# EAGLE design SB_TS_0.53_d (EAGLE 5.04)
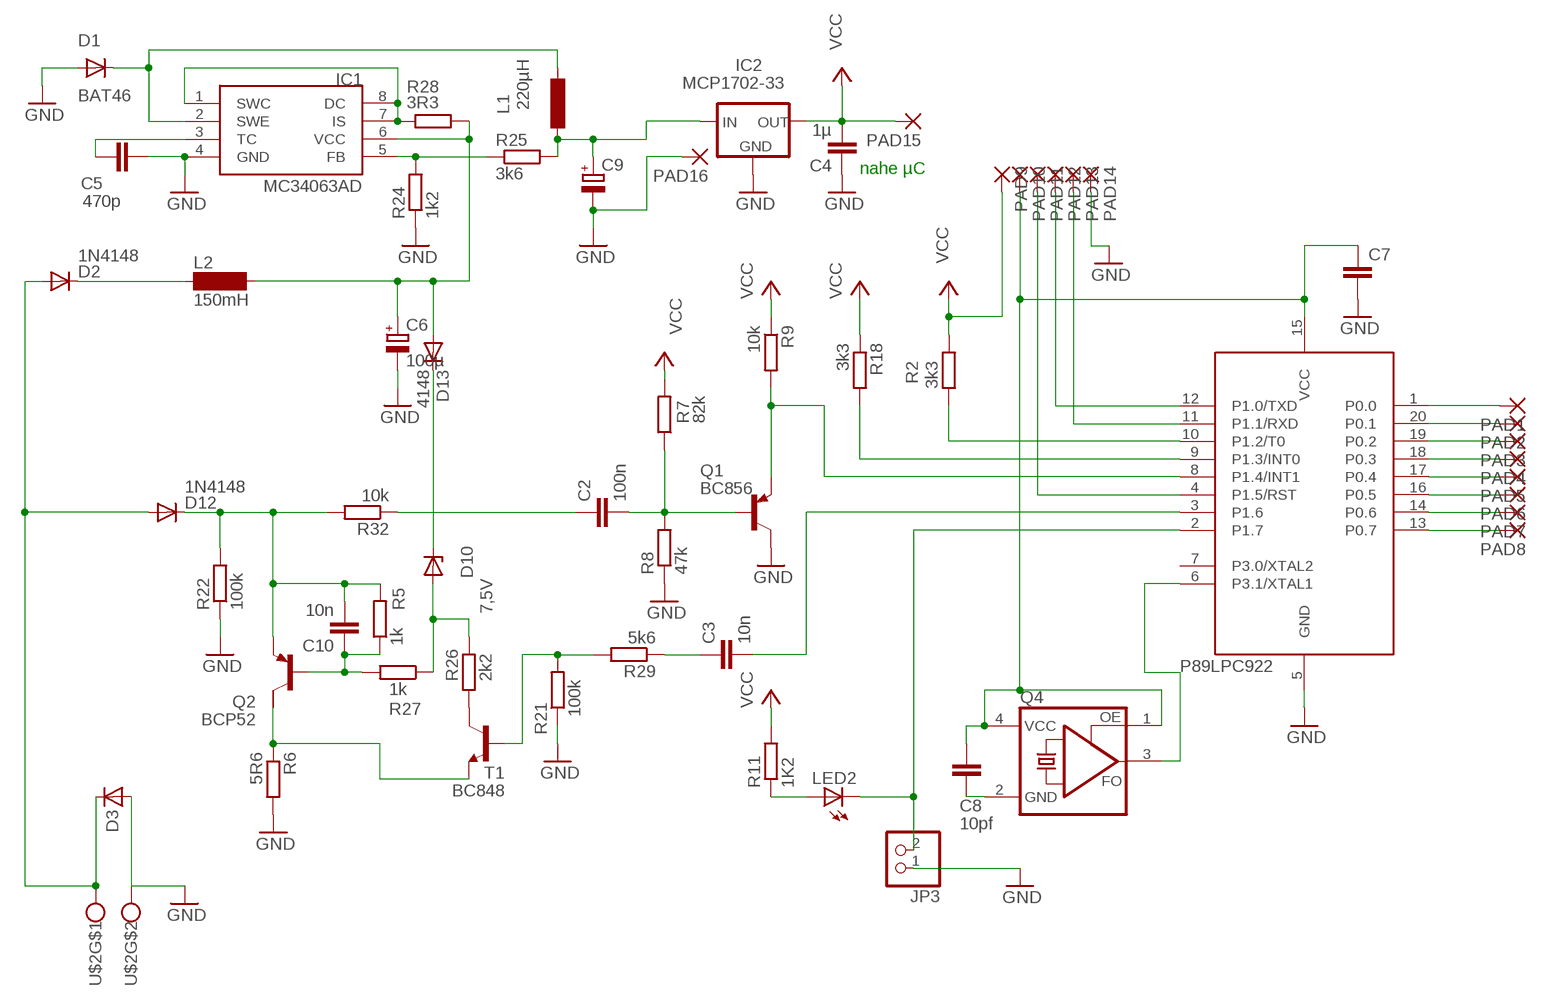
[diagram p0: schematic, sheet 1]

## Parts
C2  100n  C-EUC1206  [C1206]
C3  10n  C-EUC1206  [C1206]
C4  1µ  C-EUC1206  [C1206]
C5  470p  C-EUC1206  [C1206]
C6  100µ  CPOL-EUE5-8.5  [E5-8,5]
C7  C-EUC1206  [C1206]
C8  10pf  C-EUC1206  [C1206]
C9  CPOL-EUE2.5-5  [E2,5-5]
C10  10n  C-EUC1206  [C1206]
D1  BAT46  DIODE-MINIMELF  [MINIMELF]
D2  1N4148  DIODE-MINIMELF  [MINIMELF]
D3  SMAJ40AC  D-SMB  [SMB]
D10  7,5V  ZPD  [MINIMELF]
D12  1N4148  DIODE-MINIMELF  [MINIMELF]
D13  4148  DIODE-MINIMELF  [MINIMELF]
IC1  MC34063AD  [SOIC8]
IC2  MCP1702-33  79LXX  [79LXX]
JP3  PINHD-1X2  [1X02]
L1  220µH  L-EU2200-11.43  [2200-11.43]
L2  150mH  SD12-1000  [SD12_1000]
LED2  LED3MM  [LED3MM]
PAD1  SMD2  [SMD1,27-2,54]
PAD2  SMD2  [SMD1,27-2,54]
PAD3  SMD2  [SMD1,27-2,54]
PAD4  SMD2  [SMD1,27-2,54]
PAD5  SMD2  [SMD1,27-2,54]
PAD6  SMD2  [SMD1,27-2,54]
PAD7  SMD2  [SMD1,27-2,54]
PAD8  SMD2  [SMD1,27-2,54]
PAD9  SMD2  [SMD1,27-2,54]
PAD10  SMD2  [SMD1,27-2,54]
PAD11  SMD2  [SMD1,27-2,54]
PAD12  SMD2  [SMD1,27-2,54]
PAD13  SMD2  [SMD1,27-2,54]
PAD14  SMD2  [SMD1,27-2,54]
PAD15  SMD2  [SMD1,27-2,54]
PAD16  SMD2  [SMD1,27-2,54]
Q1  BC856  BC856ALT1SMD  [SOT23-BEC]
Q2  BCP52  FZT753SMD  [SOT223]
Q4  ASFL  [ASF]
R2  3k3  R-EU_M1206  [M1206]
R5  1k  R-EU_R1206  [R1206]
R6  5R6  R-EU_R1206  [R1206]
R7  82k  R-EU_R1206  [R1206]
R8  47k  R-EU_M1206  [M1206]
R9  10k  R-EU_R1206  [R1206]
R11  1K2  R-EU_R1206  [R1206]
R18  3k3  R-EU_R1206  [R1206]
R21  100k  R-EU_R1206  [R1206]
R22  100k  R-EU_M1206  [M1206]
R24  1k2  R-EU_R1206  [R1206]
R25  3k6  R-EU_M1206  [M1206]
R26  2k2  R-EU_M1206  [M1206]
R27  1k  R-EU_R1206  [R1206]
R28  3R3  R-EU_M1206  [M1206]
R29  5k6  R-EU_R1206  [R1206]
R32  10k  R-EU_R1206  [R1206]
T1  BC848  [SOT23]
U1  89LPC922  [DIL20]
U$2  AKL059-02  [AKL3.5X2]

## Nets
DRAIN: R26.1 T1.3(C)
EIB+: D2.A D3.1(C) D12.A U$2.1
EIB_DC1: C6.+ D13.A IC1.6(VCC) L2.2 R28.2
EIB_SEND: C3.2 U1.3(P1.6)
EIBIN: Q1.E R9.2 U1.8(P1.4/INT1)
GATE: R21.2 R29.2 T1.1(B)
GND: C4.1 C5.2 C6.- C7.2 C9.- D1.A D3.2(A) IC1.4(GND) IC2.GND JP3.1 PAD14.1(P) PAD16.1(P) Q1.C R6.2 R8.1 R21.1 R22.1 R24.1 U1.5(GND) U$2.2
INT0: R18.2 U1.9(P1.3/INT0)
N$1: C10.1 Q2.1(B) R5.1 R27.2
N$2: C3.1 R29.1
N$3: C9.+ IC2.IN L1.1 R25.2
N$5: C10.2 D12.C Q2.3(E) R5.2 R22.2 R32.2
N$6: Q2.2(C) R6.1 T1.2(E)
N$8: D2.C L2.1
N$15: PAD5.1(P) U1.17(P0.4)
N$16: PAD11.1(P) U1.4(P1.5/RST)
N$17: JP3.2 LED2.K(C) U1.2(P1.7)
N$19: LED2.A R11.1
N$20: PAD3.1(P) U1.19(P0.2)
N$21: PAD1.1(P) U1.1(P0.0)
N$22: PAD2.1(P) U1.20(P0.1)
N$23: PAD4.1(P) U1.18(P0.3)
N$24: PAD12.1(P) U1.12(P1.0/TXD)
N$25: Q4.3(FO) U1.6(P3.1/XTAL1)
N$26: PAD13.1(P) U1.11(P1.1/RXD)
N$27: C8.2 Q4.2(GND)
N$28: PAD6.1(P) U1.16(P0.5)
N$29: PAD8.1(P) U1.13(P0.7)
N$30: PAD7.1(P) U1.14(P0.6)
N$31: C2.2 Q1.B R7.1 R8.2
N$50: IC1.5(FB) R24.2 R25.1
N$51: D1.C IC1.2(SWE) L1.2
N$52: C5.1 IC1.3(TC)
N$55: D10.A R26.2 R27.1
N$58: D10.C D13.C
N$63: IC1.1(SWC) IC1.7(IS) IC1.8(DC) R28.1
N$77: C2.1 R32.1
PWM: R2.2 U1.10(P1.2/T0)
VCC: C4.2 IC2.OUT PAD9.1(P) PAD15.1(P) R2.1 R7.2 R9.1 R11.2 R18.1
VCC_LPC: C7.1 C8.1 PAD10.1(P) Q4.1(OE) Q4.4(VCC) U1.15(VCC)
Unconnected: Q2.4(C/) U1.7(P3.0/XTAL2)

## Notes on the sheet
- nahe µC
- P89LPC922

## Library data of the parts
C2-C5 C7 C8 C10 = rcl:C-EU: CAPACITOR, European symbol
C6 C9 = rcl:CPOL-EU: POLARIZED CAPACITOR, European symbol
D1 D2 D12 D13 = diode:DIODE-: DIODE
D3 = semicon-smd-ipc:D-: DIODE unfilled
D10 = diode:ZPD: Z DIODE 500 mW
IC1 = mc34063:MC34063
IC2 = v-reg:79LXX: VOLTAGE REGULATOR
JP3 = pinhead:PINHD-1X2: PIN HEADER
L1 = rcl:L-EU: INDUCTOR, European symbol
L2 = inductor-neosid:SD12: INDUCTOR nominal inductance
LED2 = led:LED: LED OSRAM: - CHIPLED LG R971, LG N971, LY N971, LG Q971, LY Q971, LO R971, LY R971 LH N974, LH R974 LS Q976, LO Q976, LY Q976 LO Q996 - Hyper CHIPLED LW Q18S LB Q993, LB Q99A, LB R99A - SideLED LS A670, LO A670, LY A670, LG A670, LP A670 LB A673, LV A673, LT A673, LW A673 LH A674 LY A675 LS A676, LA A676, LO A676, LY A676, LW A676 LS A679, LY A679, LG A679 - Hyper Micro SIDELED® LS Y876, LA Y876, LO Y876, LY Y876 LT Y87S - SmartLED LW L88C, LW L88S LB L89C, LB L89S, LG L890 LS L89K, LO L89K, LY L89K LS L896, LA L896, LO L896, LY L896 - TOPLED LS T670, LO T670, LY T670, LG T670, LP T670 LSG T670, LSP T670, LSY T670, LOP T670, LYG T670 LG T671, LOG T671, LSG T671 LB T673, LV T673, LT T673, LW T673 LH T674 LS T676, LA T676, LO T676, LY T676, LB T676, LH T676, LSB T676, LW T676 LB T67C, LV T67C, LT T67C, LS T67K, LO T67K, LY T67K, LW E67C LS E67B, LA E67B, LO E67B, LY E67B, LB E67C, LV E67C, LT E67C LW T67C LS T679, LY T679, LG T679 LS T770, LO T770, LY T770, LG T770, LP T770 LB T773, LV T773, LT T773, LW T773 LH T774 LS E675, LA E675, LY E675, LS T675 LS T776, LA T776, LO T776, LY T776, LB T776 LHGB T686 LT T68C, LB T68C - Hyper Mini TOPLED® LB M676 - Mini TOPLED Santana® LG M470 LS M47K, LO M47K, LY M47K Source: http://www.osram.convergy.de - LUMILED® LXK2-PW12-R00, LXK2-PW12-S00, LXK2-PW14-U00, LXK2-PW14-V00 LXK2-PM12-R00, LXK2-PM12-S00, LXK2-PM14-U00 LXK2-PE12-Q00, LXK2-PE12-R00, LXK2-PE12-S00, LXK2-PE14-T00, LXK2-PE14-U00 LXK2-PB12-K00, LXK2-PB12-L00, LXK2-PB12-M00, LXK2-PB14-N00, LXK2-PB14-P00, LXK2-PB14-Q00 LXK2-PR12-L00, LXK2-PR12-M00, LXK2-PR14-Q00, LXK2-PR14-R00 LXK2-PD12-Q00, LXK2-PD12-R00, LXK2-PD12-S00 LXK2-PH12-R00, LXK2-PH12-S00 LXK2-PL12-P00, LXK2-PL12-Q00, LXK2-PL12-R00 Source: www.luxeon.com
PAD1-PAD16 = wirepad:SMD2: SMD PAD
Q1 = transistor-pnp:BC856*: PNP Transistror
Q2 = transistor-pnp:FZT753SMD: PNP Transistor
Q4 = crystal:ASF*: CRYSTAL CLOCK OSCILLATORS 5.0 Vdc or 3.3 Vdc - LOW PROFILE ULTRA MINIATURE CERAMIC SURFACE MOUNT Source: http://www.abracon.com/Oscillators/asf1-L-L1.pdf
R2 R5-R9 R11 R18 R21 R22 R24-R29 R32 = rcl:R-EU_: RESISTOR, European symbol
T1 = transistor:BC848: NPN TRANSISTOR
U1 = micro-philips:89LPC922
U$2 = con-wago-500:AKL059-02

## Board
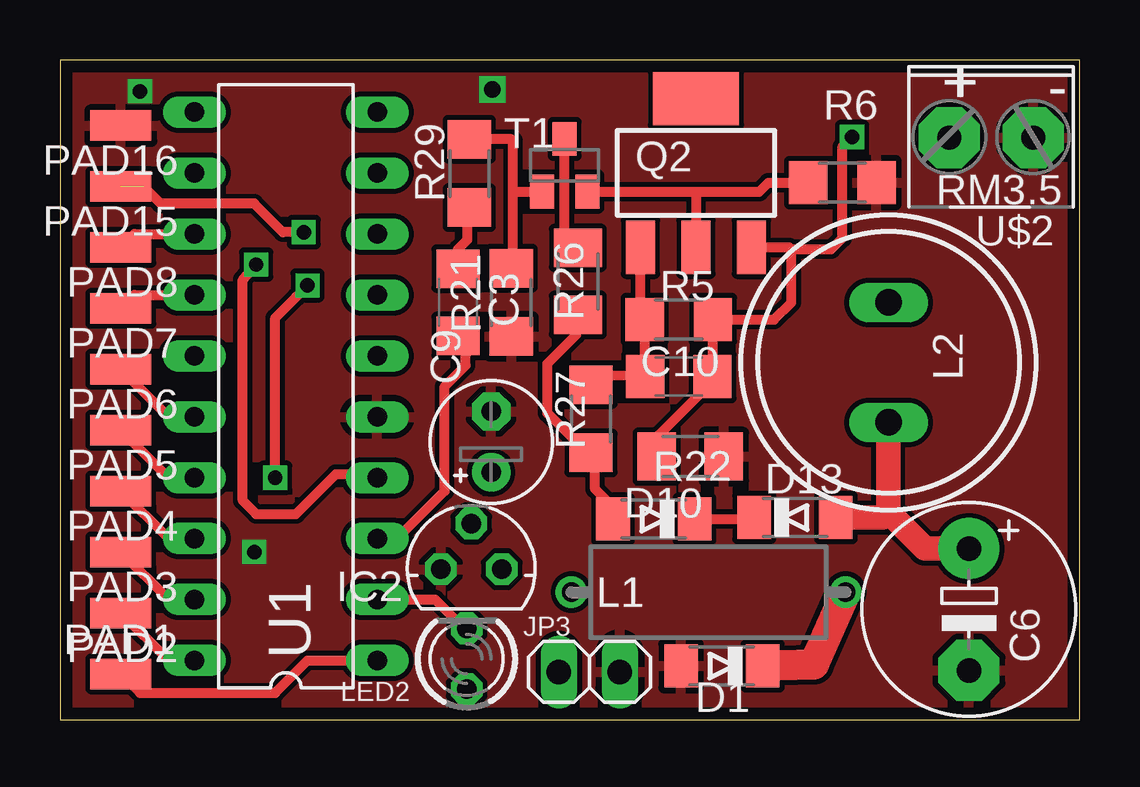
[diagram p1: board, top side]
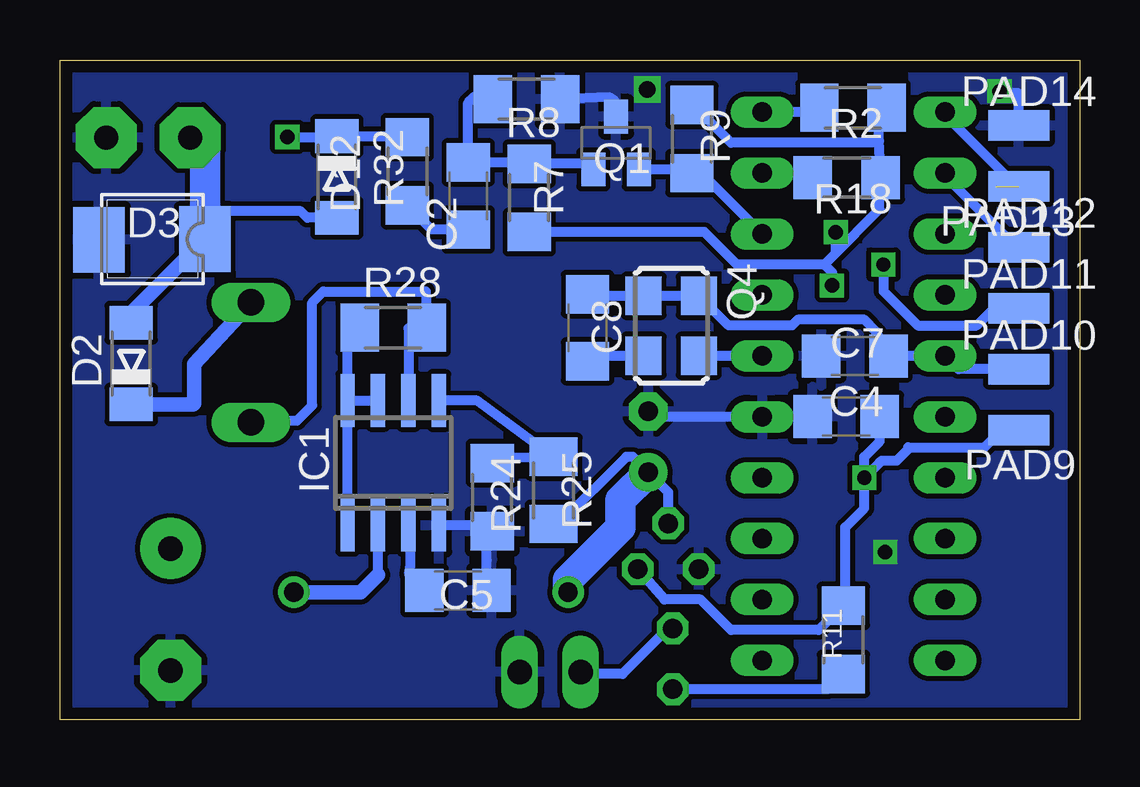
[diagram p2: board, bottom side, seen from below]

Size 42.5 x 27.5 mm. Coordinates in mm from the lower left corner, seen from the top.
Outline: 0,0 42.5,0 42.5,27.5 0,27.5 0,0
Copper layers (1*16): Top 0.035mm / dielectric 1.5mm / Bottom 0.035mm
Design rules "default *": minimum track width 10mil, minimum drill 24mil, track to track 8mil, track to pad 8mil, pad to pad 8mil, via to via 8mil, smd to smd 8mil, copper to edge 20mil, drill to drill 8mil, minimum pad ring 10mil, minimum via ring 8mil, stop-mask expansion 4mil, vias tented up to drill 0mil, thermal gap 10mil

### Footprints (pad centres in the part's own frame; a part is rotated, then mirrored left to right if it is on the bottom)
C1206 = smd 1.6 x 1.8: 1 -1.4,0; 2 1.4,0
E5-8,5 = drill 1.016 pad 2.54 round: + -2.54,0 | drill 1.016 pad 2.54 octagon: - 2.54,0
E2,5-5 = drill 0.813 pad 1.6 round: + -1.27,0 | drill 0.813 pad 1.6 octagon: - 1.27,0
MINIMELF = smd 1.4 x 1.8: A 1.7,0; C -1.7,0
SMB = smd 2.159 x 2.743: 1 -2.311,-0.127; 2 2.108,-0.102
SOIC8 = smd 0.6 x 2.2: 1 -1.905,-2.6; 2 -0.635,-2.6; 3 0.635,-2.6; 4 1.905,-2.6; 5 1.905,2.6; 6 0.635,2.6; 7 -0.635,2.6; 8 -1.905,2.6
79LXX = drill 0.813 octagon: GND -1.27,0; IN 0,1.905; OUT 1.27,0
1X02 = drill 1.016 long: 1 -1.27,0; 2 1.27,0
2200-11.43 = drill 0.8 pad 1.27 round: 1 -5.715,0; 2 5.715,0
SD12_1000 = drill 1.1 long: 1 -2.5,0; 2 2.5,0
LED3MM = drill 0.813 octagon: A -1.27,0; K 1.27,0
SMD1,27-2,54 = smd 1.27 x 2.54: 1 0,0
SOT23-BEC = smd 1 x 1.4: B -0.95,-1.1; C 0,1.1; E 0.95,-1.1
SOT223 = smd 1.219 x 2.235: 1 -2.311,-3.099; 2 0,-3.099; 3 2.311,-3.099 | smd 3.6 x 2.2: 4 0,3.099
ASF = smd 1.6 x 1.5: 1 -1.25,-1.15; 2 1.25,-1.15; 3 1.25,1.15; 4 -1.25,1.15
M1206 = smd 1.6 x 2: 1 -1.4,0; 2 1.4,0
R1206 = smd 1.6 x 1.803: 1 -1.422,0; 2 1.422,0
SOT23 = smd 1 x 1.4: 1 -0.95,-1.1; 2 0.95,-1.1; 3 0,1.1
DIL20 = drill 0.813 long: 1 -11.43,-3.81; 2 -8.89,-3.81; 3 -6.35,-3.81; 4 -3.81,-3.81; 5 -1.27,-3.81; 6 1.27,-3.81; 7 3.81,-3.81; 8 6.35,-3.81; 9 8.89,-3.81; 10 11.43,-3.81; 11 11.43,3.81; 12 8.89,3.81; 13 6.35,3.81; 14 3.81,3.81; 15 1.27,3.81; 16 -1.27,3.81; 17 -3.81,3.81; 18 -6.35,3.81; 19 -8.89,3.81; 20 -11.43,3.81
AKL3.5X2 = drill 1 pad 2.54 octagon: 1 -1.75,-0.1; 2 1.75,-0.1

### Placement (x,y rotation side)
C2  25.48,21.83 90 bottom
C3  16.59,17.39 270 top
C4  9.73,12.63 0 bottom
C5  25.91,5.38 0 bottom
C6  37.89,4.59 270 top
C7  9.37,15.16 180 bottom
C8  20.51,16.34 270 bottom
C9  17.97,11.57 90 top
C10  25.8,14.3 0 top
D1  27.59,2.24 180 top
D2  39.53,14.84 90 bottom
D3  38.77,19.9 180 bottom
D10  24.75,8.36 180 top
D12  30.96,22.62 270 bottom
D13  30.64,8.42 0 top
IC1  28.61,10.7 0 bottom
IC2  17.14,6.27 0 top
JP3  22.07,1.98 180 top
L1  27.04,5.31 0 top
L2  34.54,14.89 270 top
LED2  16.95,2.53 90 top
PAD1  2.54,1.91 270 top
PAD2  2.54,4.45 90 top
PAD3  2.54,6.99 90 top
PAD4  2.54,9.53 90 top
PAD5  2.54,12.06 90 top
PAD6  2.54,14.61 90 top
PAD7  2.54,17.14 90 top
PAD8  2.54,19.68 90 top
PAD9  2.54,12.06 90 bottom
PAD10  2.54,14.61 270 bottom
PAD11  2.54,17.14 270 bottom
PAD12  2.54,19.68 270 bottom
PAD13  2.54,22.23 90 bottom
PAD14  2.54,24.77 270 bottom
PAD15  2.54,22.23 90 top
PAD16  2.54,24.77 90 top
Q1  19.32,24.04 0 bottom
Q2  26.51,22.79 0 top
Q4  17.02,16.42 270 bottom
R2  9.44,25.5 180 bottom
R5  25.8,16.68 0 top
R6  32.61,22.38 0 top
R7  22.94,21.75 270 bottom
R8  23.05,25.86 180 bottom
R9  16.15,24.2 270 bottom
R11  9.85,3.32 90 bottom
R18  9.71,22.6 180 bottom
R21  18.81,17.39 90 top
R22  26.27,10.97 180 top
R24  24.48,9.27 90 bottom
R25  21.92,9.56 270 bottom
R26  21.59,18.27 270 top
R27  22.13,12.54 90 top
R28  28.61,16.34 0 bottom
R29  17.07,22.77 90 top
R32  28.02,22.86 90 bottom
T1  21.04,23.11 0 top
U1  9.41,13.89 90 top
U$2  38.81,24.37 0 top

### Tracks (layer width: path | path; a pad name or v marks a point on that pad's centre or on a via)
DRAIN
  Top 0.406: 21.43,19.59 R26.1 21.04,20.22 T1.3
EIB+
  Bottom 0.406: D12.A 32.19,20.92 32.46,21.19 36.46,21.19
  Bottom 0.61: D2.A 39.53,16.96 D3.1
  Bottom 1.27: D3.1 36.46,21.19 36.46,23.66 U$2.1
EIB_DC1
  Top 1.016: C6.+ 36.05,7.13 34.53,8.65 | 34.53,8.65 34.53,12.38 L2.2 | D13.A 34.3,8.43 34.53,8.65
  Bottom 0.406: IC1.6 27.97,16.31 R28.2 27.21,16.52 27.26,17.84 31.53,17.84 31.99,17.38 31.99,13.1 32.62,12.46 34.47,12.46 L2.2
EIB_SEND
  Top 0.406: U1.3 14.05,7.54 16.03,9.53 16.03,13.89 16.91,14.76 16.91,15.2 C3.2
EIBIN
  Bottom 0.406: Q1.E 16.31,22.94 R9.2 15.76,22.78 U1.8
GATE
  Top 0.406: R29.2 18.83,24.19 18.89,24.13 18.89,22.07 | 18.89,22.07 18.89,18.89 R21.2 | T1.1 18.95,22.01 18.89,22.07
GND  (via drill 0.6, 0.7)
  Top 0.406: R21.1 19.37,16.13
  Bottom 0.406: C5.2 24.75,5.75 24.72,6.65 24.72,7.93 R24.1 | IC1.4 24.73,8.1 R24.1 | R24.1 24.33,8.32 | R8.1 19.59,25.94 19.37,25.8 19.37,25.18 Q1.C | C4.1 U1.5 17.75,12.62 C9.- | PAD16.1 2.54,26.11 3.25,26.11 v3.33,26.19
  other vias: 18.02,26.27 8.1,6.99
  pour Bottom: -0.95,28.1 42.78,28.1 43.02,27.94 43.02,-0.16 42.62,-0.48 -0.24,-0.48 -0.32,-0.4 -0.32,10.56 -0.64,10.87
  pour Top: -0.32,-0.79 -0.32,28.34 42.86,28.34 42.86,-0.71 3.41,-0.71
INT0
  Bottom 0.406: U1.9 11.39,22.78 R18.2
N$1
  Top 0.406: Q2.1 24.2,16.86 R5.1 24.38,14.32 | 24.38,14.32 C10.1 | 24.38,14.32 22.78,14.37 R27.2
N$2
  Top 0.406: C3.1 16.59,19.61 16.99,20 16.99,21.27 R29.1
N$3
  Bottom 0.406: IC2.IN 17.14,9.48 C9.+ 18.62,10.95 18.89,10.95 21.69,8.16 R25.2
  Bottom 1.27: L1.1 21.32,5.83 19.13,8.02 19.13,9.15 C9.+
N$5  (via drill 0.6)
  Top 0.406: 32.99,24.32 v33.02,24.29 32.62,23.89 32.62,20.08 32.15,19.61 30.48,19.61 | Q2.3 30.4,19.68 30.48,19.61 | 30.48,19.61 30.48,17.38 29.77,16.67 27.72,16.67 27.71,16.68 R5.2 27.23,14.33 C10.2 27.2,14.1 24.92,11.83 24.92,11.02 R22.2
  Bottom 0.406: R32.2 28.02,24.53 28.13,24.32 D12.C 30.99,24.29 v33.02,24.29
N$6
  Top 0.406: T1.2 26.59,22.01 | Q2.2 26.51,21.93 26.59,22.01 | 26.59,22.01 29.15,22.01 29.53,22.38 R6.1
N$8
  Bottom 0.61: D2.C 36.94,13.14 36.91,13.18 36.91,14.82 L2.1
N$15
  Top 0.406: U1.17 4.52,10.08 PAD5.1
N$16  (via drill 0.6)
  Top 0.406: U1.4 13.07,10.24 11.51,10.24 9.84,8.57 8.18,8.57 7.62,9.13 7.62,18.34 v8.18,18.97
  Bottom 0.406: PAD11.1 3.57,17.14 4.29,16.43 6.75,16.43 8.18,17.86 v8.18,18.97
N$17
  Top 0.406: LED2.K 16.84,3.8 15.64,5 U1.2
  Bottom 0.406: LED2.K 17.15,3.8 19.05,1.91 20.8,1.91 JP3.2
N$19
  Bottom 0.406: LED2.A 10.48,1.26 R11.1
N$20
  Top 0.406: U1.19 4.52,5 PAD3.1
N$21
  Top 0.406: U1.1 10.32,2.46 8.97,1.11 3.33,1.11 PAD1.1
N$22
  Top 0.406: U1.20 4.52,2.46 PAD2.1
N$23
  Top 0.406: U1.18 4.52,7.54 PAD4.1
N$24
  Bottom 0.406: PAD12.1 2.62,19.68 5.32,22.38 5.32,22.5 U1.12
N$25
  Bottom 0.406: U1.6 Q4.3
N$26
  Bottom 0.406: PAD13.1 2.62,22.23 5.16,24.77 5.16,24.88 U1.11
N$27
  Bottom 0.406: Q4.2 20.28,15.17 C8.2
N$28
  Top 0.406: U1.16 4.52,12.62 PAD6.1
N$29
  Top 0.406: U1.13 3.1,20.24 PAD8.1
N$30
  Top 0.406: U1.14 3.1,17.7 PAD7.1
N$31
  Bottom 0.406: R8.2 24.52,25.96 25.24,25.96 25.48,25.72 C2.2 23,23.23 R7.1 20.5,23.17 Q1.B
N$50
  Bottom 0.406: IC1.5 25.11,13.3 R25.1 24.61,10.88 R24.2
N$51
  Top 1.27: D1.C 31.43,2.3 L1.2
  Bottom 0.406: 29.24,6.04 IC1.2
  Bottom 0.61: 29.24,6.04 29.97,5.31 L1.2
N$52
  Bottom 0.406: C5.1 27.94,6.05 27.89,6.42 27.89,8.02 IC1.3
N$55
  Top 0.406: D10.A 23.05,8.86 22.3,9.6 22.3,11.11 R27.1 21.98,11.12 20.32,12.78 20.32,14.84 21.51,16.03 21.51,16.79 R26.2
N$58
  Top 0.406: 28.85,8.33 D13.C 28.87,8.36 D10.C
N$63
  Bottom 0.406: IC1.8 30.51,15.89 R28.1 | IC1.8 IC1.7 | IC1.1 IC1.8
N$77
  Bottom 0.406: C2.1 27.01,20.43 R32.1
PWM
  Bottom 0.406: R2.2 11.17,25.66 11.51,25.32 U1.10
VCC  (via drill 0.6)  (1 unrouted)
  Top 0.406: v8.97,10.08 8.97,16.75 9.84,17.62 v10.32,18.1 | 3.49,22.23 4.21,21.51 8.1,21.51 9.29,20.32 v10.16,20.32
  Bottom 0.406: R2.1 8.36,25.66 8.36,24.13 | 8.36,24.13 R18.1 8.33,22.57 8.33,21.27 10.28,19.33 | R9.1 16.1,25.62 14.53,24.05 8.44,24.05 8.36,24.13 | R7.2 15.64,20.33 14.29,18.97 10.64,18.97 | v8.97,10.08 8.33,10.72 8.26,10.79 7.62,10.79 7.14,11.27 7.14,11.35 3.97,11.35 3.25,12.06 PAD9.1 | 10.64,18.97 10.28,19.33 | v10.32,18.1 10.32,18.65 10.64,18.97 | 14.53,3.73 10.87,3.73 10.16,4.45 10.15,4.45 R11.2 9.76,4.83 9.76,8.02 8.97,8.81 v8.97,10.08 | v10.16,20.32 10.16,19.45 10.28,19.33 | 14.53,3.73 | 14.53,3.73 15.8,5 17.3,5 IC2.OUT | C4.2 8.33,11.6 8.97,10.95 v8.97,10.08
VCC_LPC
  Bottom 0.406: C8.1 20.12,17.67 Q4.1 Q4.4 14.63,16.43 11.99,16.43 11.75,16.67 8.97,16.67 8.44,16.14 C7.1 8.44,15.16 6.51,15.16 U1.15 5.05,14.61 PAD10.1

### Text on the board
tPlace: - | + | +